# EAGLE design SparkFun_APDS-9960_RGB_and_Gesture_Sensor (EAGLE 6.5.0)
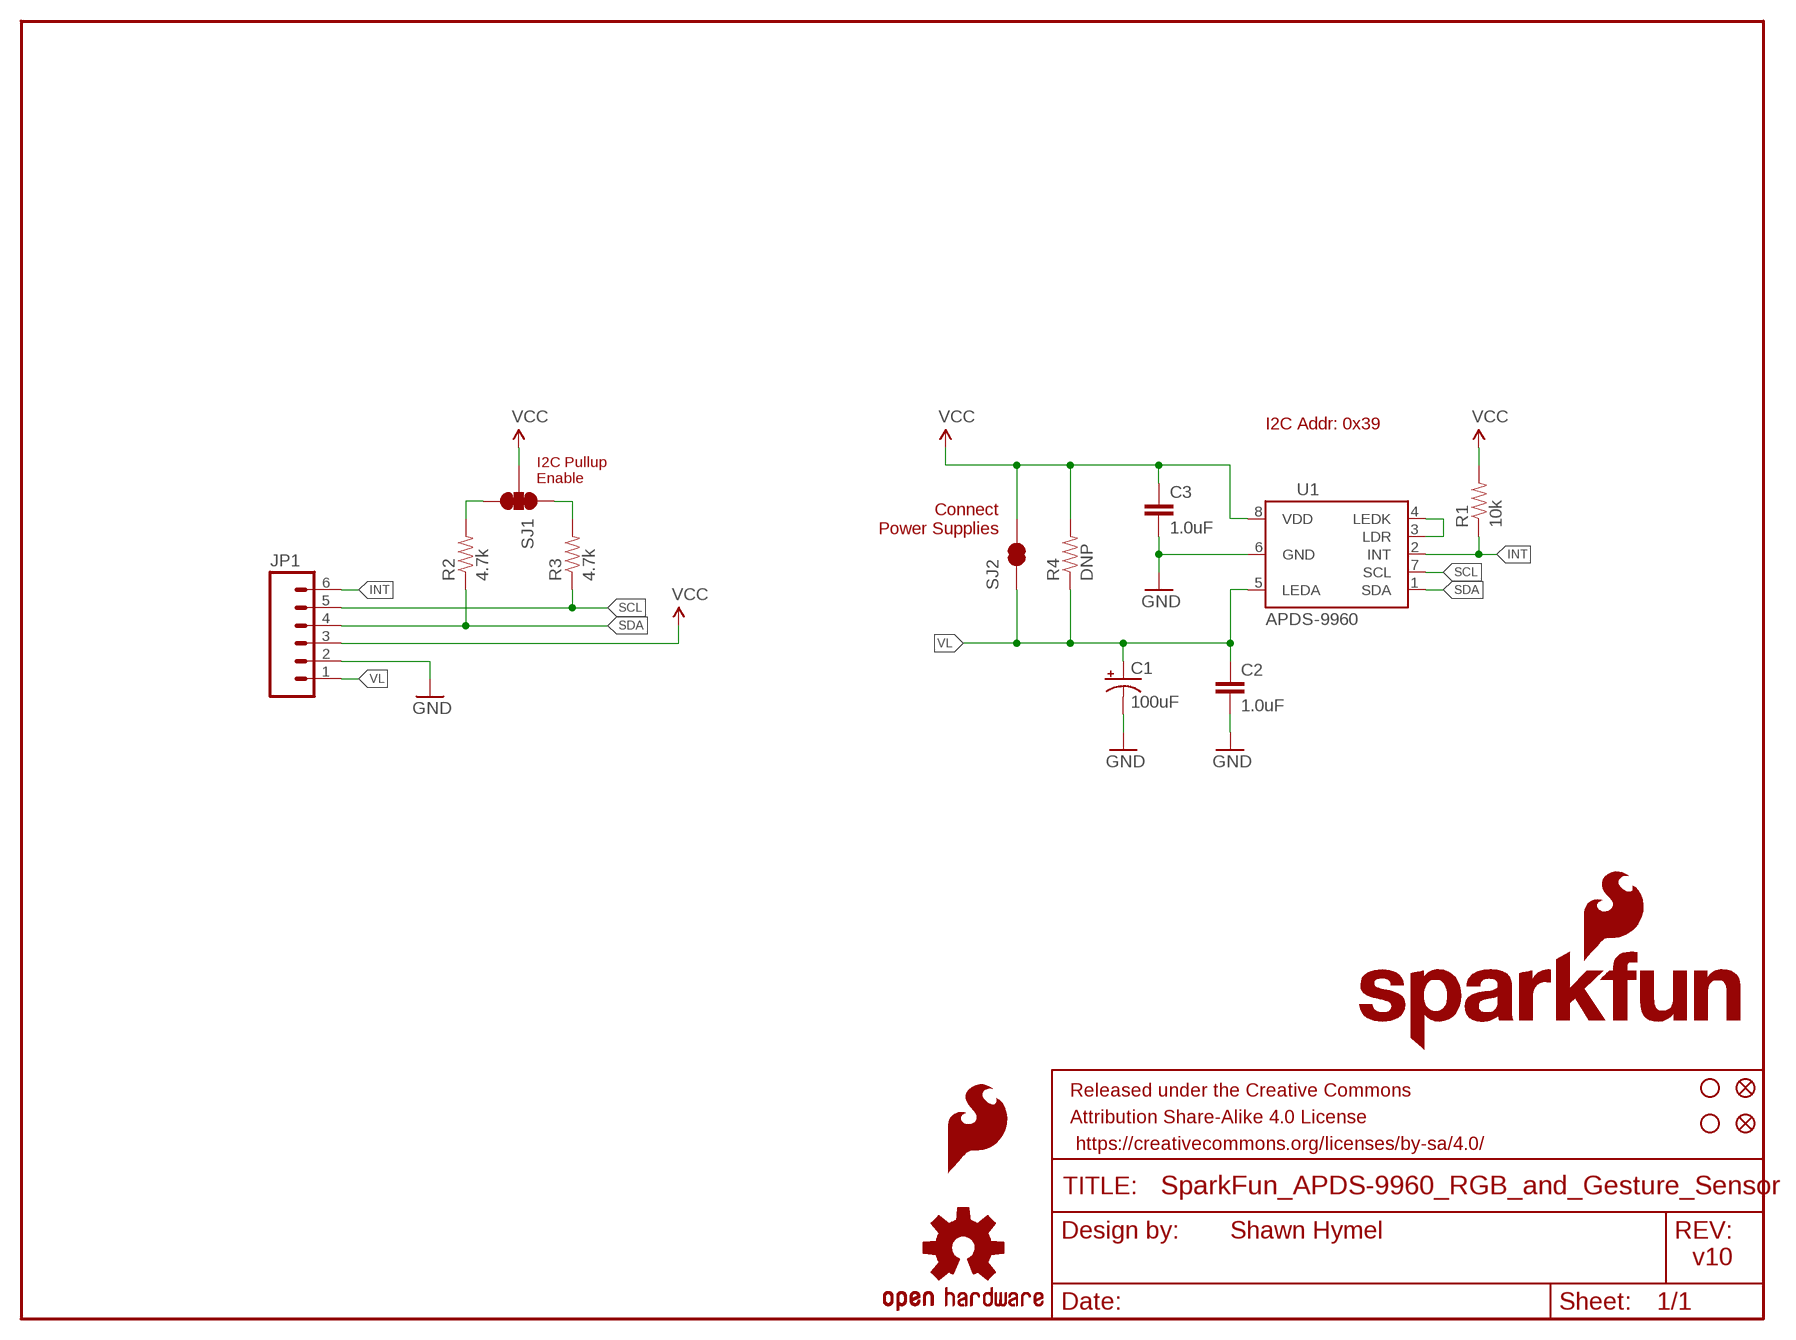
[diagram p0: schematic, sheet 1]

## Parts
C1  100uF  100UF-10V-10%(TANT)  [EIA7343]
C2  1.0uF  1.0UF-16V-10%(0603)  [0603-CAP]
C3  1.0uF  1.0UF-16V-10%(0603)  [0603-CAP]
FID1  FIDUCIAL1X2  [FIDUCIAL-1X2]
FID2  FIDUCIAL1X2  [FIDUCIAL-1X2]
FRAME1  FRAME-LETTER  [CREATIVE_COMMONS]
JP1  M06SIP  [1X06]
LOGO1  SFE_LOGO_FLAME.1_INCH  [SFE_LOGO_FLAME_.1]
LOGO2  OSHW-LOGOS  [OSHW-LOGO-S]
R1  10k  10KOHM1/10W1%(0603)0603  [0603-RES]
R2  4.7k  4.7KOHM1/10W1%(0603)  [0603]
R3  4.7k  4.7KOHM1/10W1%(0603)  [0603]
R4  DNP  RESISTOR0603  [0603-RES]
SJ1  SOLDERJUMPER_2WAYPASTE1&2&3  [SJ_3_PASTE1&2&3]
SJ2  SOLDERJUMPERNC  [SJ_2S]
STANDOFF1  STAND-OFF  [STAND-OFF]
STANDOFF2  STAND-OFF  [STAND-OFF]
U1  APDS-9960  [APDS-9960]
U$1  SFE_LOGO_NAME_FLAME.1_INCH  [SFE_LOGO_NAME_FLAME_.1]

## Nets
GND: C1.C(-) C2.2 C3.2 JP1.2 U1.6(GND)
INT: JP1.6 R1.1 U1.2(INT)
N$1: R2.2 SJ1.3
N$2: R3.2 SJ1.1
N$4: U1.3(LDR) U1.4(LEDK)
SCL: JP1.5 R3.1 U1.7(SCL)
SDA: JP1.4 R2.1 U1.1(SDA)
VCC: C3.1 JP1.3 R1.2 R4.2 SJ1.2 SJ2.2 U1.8(VDD)
VL: C1.A(+) C2.1 JP1.1 R4.1 SJ2.1 U1.5(LEDA)

## Notes on the sheet
- I2C Addr: 0x39
- I2C Pullup
  Enable
- Connect
  Power Supplies
- Shawn Hymel
- v10

## Library data of the parts
C1 = SparkFun-Capacitors:100UF-10V-10%(TANT): CAP-07890; PROD_ID: CAP-07890
C2 C3 = SparkFun-Capacitors:1.0UF-16V-10%(0603): CAP-00868; PROD_ID: CAP-00868
FID1 FID2 = SparkFun-Aesthetics:FIDUCIAL: Fiducial Alignment Points Various fiducial points for machine vision alignment.
FRAME1 = SparkFun-Aesthetics:FRAME-LETTER: Schematic Frame Standard 8.5x11 US Letter frame
JP1 = SparkFun-Connectors:M06: Header 6 Standard 6-pin 0.1" header. Use with straight break away headers (SKU : PRT-00116), right angle break away headers (PRT-00553), swiss pins (PRT-00743), machine pins (PRT-00117), and female headers (PRT-00115). Molex polarized connector foot print use with SKU : PRT-08094 with associated crimp pins and housings. NOTES ON THE VARIANTS LOCK and LOCK_LONGPADS... This footprint was designed to help hold the alignment of a through-hole component (i.e. 6-pin header) while soldering it into place. You may notice that each hole has been shifted either up or down by 0.005 of an inch from it's more standard position (which is a perfectly straight line). This slight alteration caused the pins (the squares in the middle) to touch the edges of the holes. Because they are alternating, it causes a "brace" to hold the component in place. 0.005 has proven to be the perfect amount of "off-center" position when using our standard breakaway headers. Although looks a little odd when you look at the bare footprint, once you have a header in there, the alteration is very hard to notice. Also,if you push a header all the way into place, it is covered up entirely on the bottom side. This idea of altering the position of holes to aid alignment will be further integrated into the Sparkfun Library for other footprints. It can help hold any component with 3 or more connection pins.
LOGO1 = SparkFun-Aesthetics:SFE_LOGO_FLAME: SFE Logo, flame only This is the SparkFun flame logo. The logo on the schematic will always be the same size; the package variant is the height of the flame. Default layer for the logo on the board is tSilk.
LOGO2 = SparkFun-Aesthetics:OSHW-LOGO: Open Source Hardware Logo This logo indicates the piece of hardware it is found on incorporates a OSHW license and/or adheres to the definition of open source hardware found here: http://freedomdefined.org/OSHW
R1 = SparkFun-Resistors:10KOHM1/10W1%(0603): RES-00824; PROD_ID: RES-00824; VALUE: 10K
R2 R3 = SparkFun-Resistors:4.7KOHM1/10W1%(0603): RES-07857; PROD_ID: RES-07857
R4 = SparkFun-Resistors:RESISTOR: Resistor Basic schematic elements and footprints for 0603, 1206, and PTH resistors.
SJ1 = SparkFun-Passives:SOLDERJUMPER_2WAY: Solder Jumper 2 way solder jumper
SJ2 = SparkFun-Retired:SOLDERJUMPER: Solder Jumper Standard SMD solder jumper. Used to automate production. Two varients : Normally Open and Normally Closed are the same, but have different paste layers. NC will have a large amount of paste and should jumper during reflow.
STANDOFF1 STANDOFF2 = SparkFun-Electromechanical:STAND-OFF: #4 Stand Off This is the mechanical footprint for a #4 phillips button head screw. Use the keepout ring to avoid running the screw head into surrounding components. SKU : PRT-00447
U1 = SparkFun-Sensors:APDS-9960: Avago APDS-9960 digital proximity, ambient light, RGB, and gesture sensor.; PROD_ID: SEN-12005
U$1 = SparkFun-Aesthetics:SFE_LOGO_NAME_FLAME: SFE Logo, name and flame This is the SparkFun full logo. The logo on the schematic will always be the same size; the package variant is the height of the flame part of the logo. Default layer for the logo on the board is tSilk.

## Board
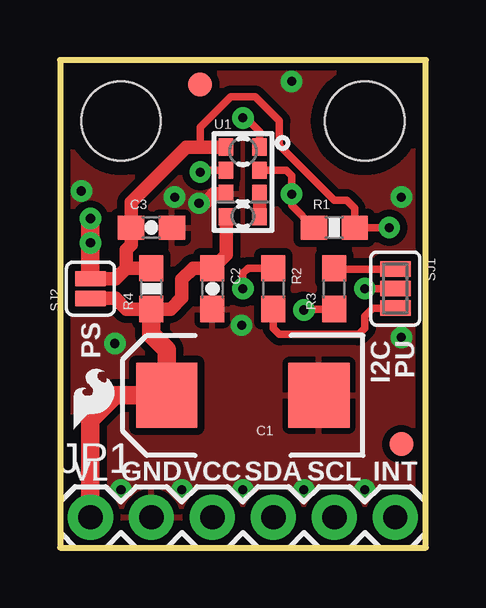
[diagram p1: board, top side]
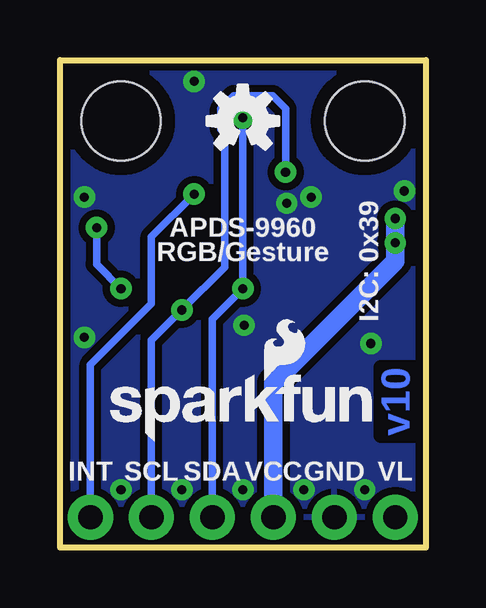
[diagram p2: board, bottom side, seen from below]

Size 15.24 x 20.32 mm. Coordinates in mm from the lower left corner, seen from the top.
Outline: 0,20.32 0,0 15.24,0 15.24,20.32 0,20.32
Copper layers (1*16): Top 0.035mm / dielectric 1.5mm / Bottom 0.035mm
Design rules "SparkFun-2-layer": minimum track width 7mil, minimum drill 15mil, track to track 8mil, track to pad 8mil, pad to pad 8mil, via to via 8mil, smd to smd 8mil, copper to edge 8mil, drill to drill 8mil, minimum pad ring 12mil, minimum via ring 10mil, stop-mask expansion 4mil, vias tented up to drill 20mil, thermal gap 10mil

### Footprints (pad centres in the part's own frame; a part is rotated, then mirrored left to right if it is on the bottom)
EIA7343 = smd 2.55 x 2.7: A 3.17,0; C -3.17,0
0603-CAP = smd 1.1 x 1: 1 -0.85,0; 2 0.85,0
FIDUCIAL-1X2 = smd 1 x 1: 1 0,0
1X06 = drill 1.016 pad 1.88: 1 0,0; 2 2.54,0; 3 5.08,0; 4 7.62,0; 5 10.16,0; 6 12.7,0
0603-RES = smd 1.1 x 1: 1 -0.85,0; 2 0.85,0
0603 = smd 1.1 x 1: 1 -0.85,0; 2 0.85,0
SJ_3_PASTE1&2&3 = smd 0.635 x 1.27: 1 -0.813,0; 2 0,0; 3 0.813,0
SJ_2S = smd 0.635 x 1.27: 1 -0.412,0; 2 0.412,0
STAND-OFF = hole 3.302: 0,0
APDS-9960 = smd 0.6 x 0.72: 1 0.7,1.455; 2 0.7,0.485; 3 0.7,-0.485; 4 0.7,-1.455; 5 -0.7,-1.455; 6 -0.7,-0.485; 7 -0.7,0.485; 8 -0.7,1.455

### Placement (x,y rotation side)
C1  7.62,6.35 180 top
C2  6.35,10.79 270 top
C3  3.81,13.34 0 top
FID1  14.22,4.32 0 top
FID2  5.84,19.3 0 top
FRAME1  -24.13,-10.16 0 top  (outside the outline)
JP1  1.27,1.27 0 top
LOGO1  0.25,4.57 0 top
LOGO2  7.62,17.78 0 bottom
R1  11.43,13.34 0 top
R2  8.89,10.79 270 top
R3  11.43,10.79 90 top
R4  3.81,10.79 90 top
SJ1  13.97,10.79 270 top
SJ2  1.27,10.79 90 top
STANDOFF1  2.54,17.78 0 top
STANDOFF2  12.7,17.78 0 top
U1  7.62,15.24 0 top
U$1  13.59,4.32 0 bottom

### Tracks (layer width: path | path; a pad name or v marks a point on that pad's centre or on a via)
GND  (via drill 0.38)
  Top 0.559: U1.6 6.4,14.76 6.4,14.73 6.07,14.4
  other vias: 5.79,14.35 4.78,14.61 7.57,9.27 7.62,2.41 12.7,2.41 14.22,8.76 10.16,2.41 2.54,2.41 5.08,2.41 2.29,8.51 9.65,19.43 14.22,14.61 0.89,14.86
  pour Top (isolate 0.305): 0,20.32 15.24,20.32 15.24,0 0,0
  pour Bottom (isolate 0.305): 0,20.32 15.24,20.32 15.24,0 0,0
INT  (via drill 0.38)
  Top 0.305: U1.2 9.42,15.72 9.65,15.49 v9.65,14.73 9.65,14.26 R1.1
  Bottom 0.305: JP1.6 13.97,7.62 11.43,10.16 11.43,12.95 v9.65,14.73
N$1
  Top 0.305: R2.2 8.89,9.14 9.14,8.89 12.45,8.89 12.7,9.14 12.7,9.65 13.03,9.98 SJ1.3
N$2
  Top 0.305: SJ1.1 11.47,11.61 R3.2
N$4
  Top 0.559: U1.4 U1.3
SCL  (via drill 0.38)
  Top 0.305: U1.7 5.92,15.72 v5.84,15.65 | R3.1 10.2,9.95 v10.16,9.91
  Bottom 0.305: JP1.5 11.43,8.64 v10.16,9.91 8.38,11.68 8.38,17.27 8.53,17.42 8.53,18.29 8,18.82 6.38,18.82 5.84,18.29 v5.84,15.65
SDA  (via drill 0.38)
  Top 0.305: v7.62,10.79 7.62,11.43 7.83,11.64 R2.1 | U1.1 8.32,17.33 7.75,17.91 v7.62,17.91
  Bottom 0.305: v7.62,17.91 v7.62,10.79 8.89,9.53 JP1.4
VCC  (via drill 0.38)
  Top 0.305: SJ1.2 v12.7,10.79 | v13.72,13.34 R1.2 12.28,14.14 11.94,14.48 11.43,14.48 9.14,16.76 9.14,17.78 8.13,18.8 7.11,18.8 5.84,17.53 5.84,16.7
  Top 0.559: 2.75,11.64 2.32,11.21 SJ2.2 1.27,11.4 | R4.2 2.75,11.64 | 2.75,11.64 2.75,12.41 2.96,12.61 C3.1 2.96,14.39 5.26,16.7 5.84,16.7 U1.8
  Top 0.762: 1.27,11.4 v1.27,12.7 v1.27,13.72
  Bottom 0.305: v13.72,13.34 13.72,11.81 v12.7,10.79
  Bottom 0.762: v1.27,13.72 v1.27,12.7 1.27,11.94 6.35,6.86 JP1.3
VL
  Top 0.559: SJ2.1 2.32,10.38 2.75,9.95 R4.1 4.61,9.95 5.08,10.41 5.08,11.18 5.55,11.64 C2.1 6.92,12.21 U1.5
  Top 0.762: R4.1 3.81,8.89 4.45,8.25 C1.A 2.29,6.35 1.27,5.33 JP1.1

### Text on the board
Bottom: v10
tPlace: PS | I2C | PU | VL | GND | VCC | SDA | SCL | INT
bPlace: APDS-9960 | I2C: 0x39 | RGB/Gesture | VL | GND | VCC | SDA | SCL | INT
tDocu: Shawn Hymel